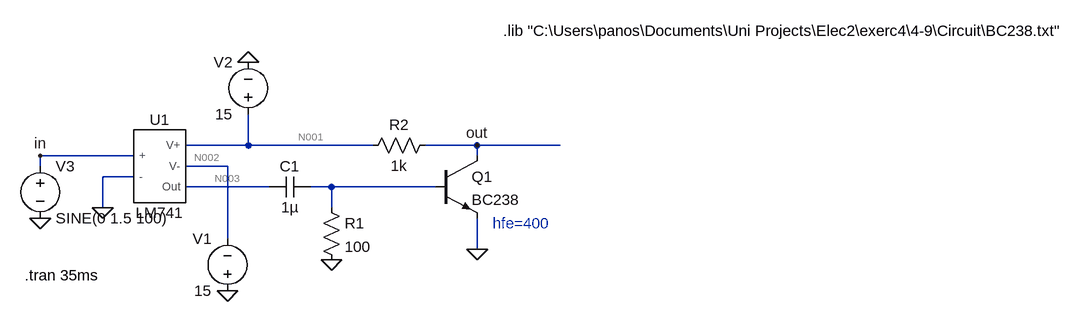
[diagram p0: schematic 4-9.asc]
4-9.asc, the LTspice schematic file:
Version 4.1
SHEET 1 1612 680
WIRE 224 352 224 304
WIRE 224 352 128 352
WIRE 416 352 224 352
WIRE 576 352 496 352
WIRE 704 352 576 352
WIRE 48 368 -96 368
WIRE 576 368 576 352
WIRE -96 384 -96 368
WIRE 192 384 128 384
WIRE 48 400 0 400
WIRE 256 416 128 416
WIRE 352 416 320 416
WIRE 512 416 352 416
WIRE 0 448 0 400
WIRE 352 448 352 416
WIRE 192 496 192 384
WIRE 576 512 576 464
FLAG 224 224 0
FLAG 192 576 0
FLAG 0 448 0
FLAG -96 464 0
FLAG 352 528 0
FLAG 576 512 0
FLAG 576 352 out
FLAG -96 368 in
SYMBOL npn 512 368 R0
SYMATTR InstName Q1
SYMATTR Value BC238
SYMBOL LM741 80 384 R0
SYMATTR InstName U1
SYMBOL voltage 192 592 R180
WINDOW 0 24 96 Left 2
WINDOW 3 24 16 Left 2
WINDOW 123 0 0 Left 0
WINDOW 39 0 0 Left 0
SYMATTR InstName V1
SYMATTR Value 15
SYMBOL voltage 224 320 R180
WINDOW 0 24 96 Left 2
WINDOW 3 24 16 Left 2
WINDOW 123 0 0 Left 0
WINDOW 39 0 0 Left 0
SYMATTR InstName V2
SYMATTR Value 15
SYMBOL voltage -96 368 R0
WINDOW 123 0 0 Left 0
WINDOW 39 0 0 Left 0
SYMATTR InstName V3
SYMATTR Value SINE(0 1.5 100)
SYMBOL cap 320 400 R90
WINDOW 0 0 32 VBottom 2
WINDOW 3 32 32 VTop 2
SYMATTR InstName C1
SYMATTR Value 1µ
SYMBOL res 336 432 R0
SYMATTR InstName R1
SYMATTR Value 100
SYMBOL res 512 336 R90
WINDOW 0 0 56 VBottom 2
WINDOW 3 32 56 VTop 2
SYMATTR InstName R2
SYMATTR Value 1k
TEXT 616 176 Left 2 !.lib "C:\\Users\\panos\\Documents\\Uni Projects\\Elec2\\exerc4\\4-9\\Circuit\\BC238.txt"
TEXT 600 472 Left 2 ;hfe=400
TEXT -120 552 Left 2 !.tran 35ms

The netlist it stands for:
* 4-9.asc
Q1 out N004 0 0 BC238
X§U1 in 0 N001 N002 N003 LM741  ; pins + - V+ V- Out
V1 0 N002 15
V2 N001 0 15
V3 in 0 SINE(0 1.5 100)
C1 N004 N003 1µ
R1 N004 0 100
R2 out N001 1k
.model NPN NPN
.model PNP PNP
.lib standard.bjt
.lib "C:\Users\panos\Documents\Uni Projects\Elec2\exerc4\4-9\Circuit\BC238.txt"
* hfe=400
.tran 35ms
.lib lm741.lib
.backanno
.end

* Results of the author's LTspice run, read from the files saved beside the schematic
* Operating Point, zero values left out:
*   V(n001) = 15 V
*   V(n002) = -15 V
*   V(n003) = 13.92 V
*   V(out) = 15 V
*   I(R1) = 15.17 pA
*   I(R2) = -15.19 pA
*   I(V1) = -1.701 mA
*   I(V2) = -1.701 mA
*   I(V3) = -61.4 nA
*   Ib(Q1) = -15.17 pA
*   Ic(Q1) = 15.2 pA
*   Ix(u1:1) = 61.4 nA
*   Ix(u1:2) = 98.31 nA
*   Ix(u1:50) = -1.701 mA
*   Ix(u1:99) = 1.701 mA
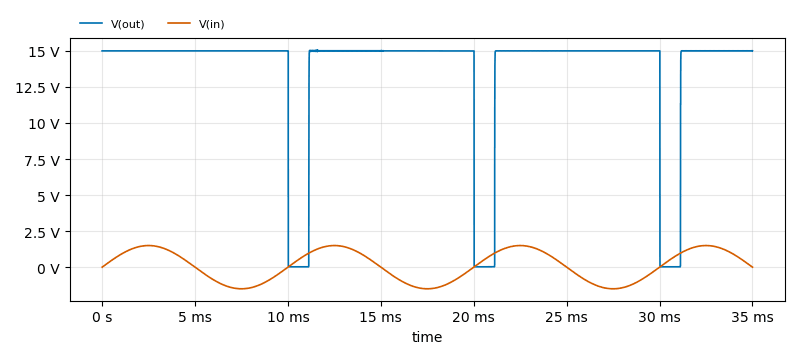
[diagram p1: Transient Analysis of 4-9.asc, plotted from the saved traces]
* Transient Analysis, 1 run:
*   V(out): min 19.57 mV, max 15.04 V, average 13.57 V, rms 14.26 V, last 15.01 V
*   V(in): min -1.5 V, max 1.5 V, average 136.4 mV, rms 1.061 V, last 0 V